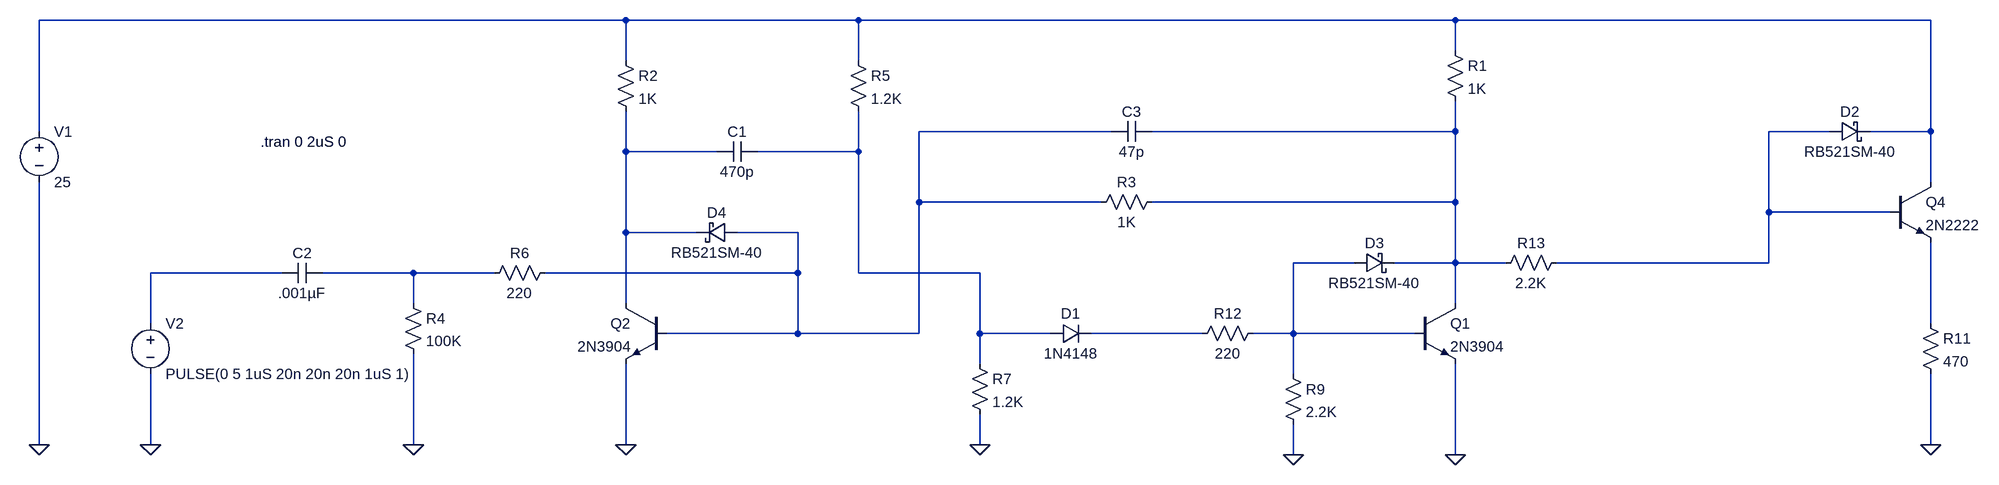
[diagram p0: schematic monostable.asc]
monostable.asc, the LTspice schematic file:
Version 4
SHEET 1 1792 680
WIRE -352 -320 -1280 -320
WIRE 16 -320 -352 -320
WIRE 960 -320 16 -320
WIRE 1712 -320 960 -320
WIRE 960 -272 960 -320
WIRE -352 -256 -352 -320
WIRE 16 -256 16 -320
WIRE -1280 -144 -1280 -320
WIRE 416 -144 112 -144
WIRE 960 -144 960 -192
WIRE 960 -144 480 -144
WIRE 1552 -144 1456 -144
WIRE 1712 -144 1712 -320
WIRE 1712 -144 1616 -144
WIRE -352 -112 -352 -176
WIRE -208 -112 -352 -112
WIRE 16 -112 16 -176
WIRE 16 -112 -144 -112
WIRE 1712 -64 1712 -144
WIRE 112 -32 112 -144
WIRE 400 -32 112 -32
WIRE 960 -32 960 -144
WIRE 960 -32 480 -32
WIRE 1456 -16 1456 -144
WIRE 1648 -16 1456 -16
WIRE -352 16 -352 -112
WIRE -240 16 -352 16
WIRE -80 16 -176 16
WIRE 800 64 704 64
WIRE 960 64 960 -32
WIRE 960 64 864 64
WIRE 1040 64 960 64
WIRE 1456 64 1456 -16
WIRE 1456 64 1120 64
WIRE -896 80 -1104 80
WIRE -688 80 -832 80
WIRE -560 80 -688 80
WIRE -80 80 -80 16
WIRE -80 80 -480 80
WIRE 16 80 16 -112
WIRE 208 80 16 80
WIRE -688 128 -688 80
WIRE -352 128 -352 16
WIRE 960 128 960 64
WIRE -1104 160 -1104 80
WIRE 1712 160 1712 32
WIRE -80 176 -80 80
WIRE -80 176 -288 176
WIRE 112 176 112 -32
WIRE 112 176 -80 176
WIRE 208 176 208 80
WIRE 320 176 208 176
WIRE 560 176 384 176
WIRE 704 176 704 64
WIRE 704 176 640 176
WIRE 896 176 704 176
WIRE 208 224 208 176
WIRE 704 240 704 176
WIRE -1280 352 -1280 -64
WIRE -1104 352 -1104 240
WIRE -688 352 -688 208
WIRE -352 352 -352 224
WIRE 208 352 208 304
WIRE 1712 352 1712 240
WIRE 704 368 704 320
WIRE 960 368 960 224
FLAG -352 352 0
FLAG 960 368 0
FLAG -1280 352 0
FLAG -688 352 0
FLAG -1104 352 0
FLAG 208 352 0
FLAG 1712 352 0
FLAG 704 368 0
SYMBOL npn 896 128 R0
SYMATTR InstName Q1
SYMATTR Value 2N3904
SYMBOL npn -288 128 M0
SYMATTR InstName Q2
SYMATTR Value 2N3904
SYMBOL res 944 -288 R0
SYMATTR InstName R1
SYMATTR Value 1K
SYMBOL res -368 -272 R0
SYMATTR InstName R2
SYMATTR Value 1K
SYMBOL cap -144 -128 R90
WINDOW 0 0 32 VBottom 2
WINDOW 3 32 32 VTop 2
SYMATTR InstName C1
SYMATTR Value 470p
SYMBOL res 496 -48 R90
WINDOW 0 0 56 VBottom 2
WINDOW 3 32 56 VTop 2
SYMATTR InstName R3
SYMATTR Value 1K
SYMBOL voltage -1280 -160 R0
WINDOW 123 0 0 Left 2
WINDOW 39 0 0 Left 2
SYMATTR InstName V1
SYMATTR Value 25
SYMBOL res -704 112 R0
SYMATTR InstName R4
SYMATTR Value 100K
SYMBOL cap -832 64 R90
WINDOW 0 0 32 VBottom 2
WINDOW 3 32 32 VTop 2
SYMATTR InstName C2
SYMATTR Value .001µF
SYMBOL voltage -1104 144 R0
WINDOW 123 0 0 Left 2
WINDOW 39 0 0 Left 2
SYMATTR InstName V2
SYMATTR Value PULSE(0 5 1uS 20n 20n 20n 1uS 1)
SYMBOL res 0 -272 R0
SYMATTR InstName R5
SYMATTR Value 1.2K
SYMBOL res -464 64 R90
WINDOW 0 0 56 VBottom 2
WINDOW 3 32 56 VTop 2
SYMATTR InstName R6
SYMATTR Value 220
SYMBOL diode 320 160 M90
WINDOW 0 0 32 VBottom 2
WINDOW 3 32 32 VTop 2
SYMATTR InstName D1
SYMATTR Value 1N4148
SYMBOL schottky 800 48 M90
WINDOW 0 0 32 VBottom 2
WINDOW 3 32 32 VTop 2
SYMATTR InstName D3
SYMATTR Value RB521SM-40
SYMATTR Description Diode
SYMATTR Type diode
SYMBOL schottky -176 0 R90
WINDOW 0 0 32 VBottom 2
WINDOW 3 32 32 VTop 2
SYMATTR InstName D4
SYMATTR Value RB521SM-40
SYMATTR Description Diode
SYMATTR Type diode
SYMBOL res 192 208 R0
SYMATTR InstName R7
SYMATTR Value 1.2K
SYMBOL cap 480 -160 R90
WINDOW 0 0 32 VBottom 2
WINDOW 3 32 32 VTop 2
SYMATTR InstName C3
SYMATTR Value 47p
SYMBOL npn 1648 -64 R0
SYMATTR InstName Q4
SYMATTR Value 2N2222
SYMBOL res 1696 144 R0
SYMATTR InstName R11
SYMATTR Value 470
SYMBOL schottky 1552 -160 M90
WINDOW 0 0 32 VBottom 2
WINDOW 3 32 32 VTop 2
SYMATTR InstName D2
SYMATTR Value RB521SM-40
SYMATTR Description Diode
SYMATTR Type diode
SYMBOL res 656 160 R90
WINDOW 0 0 56 VBottom 2
WINDOW 3 32 56 VTop 2
SYMATTR InstName R12
SYMATTR Value 220
SYMBOL res 688 224 R0
SYMATTR InstName R9
SYMATTR Value 2.2K
SYMBOL res 1136 48 R90
WINDOW 0 0 56 VBottom 2
WINDOW 3 32 56 VTop 2
SYMATTR InstName R13
SYMATTR Value 2.2K
TEXT -930 -128 Left 2 !.tran 0 2uS 0

The netlist it stands for:
* monostable.asc
Q1 N003 N007 0 0 2N3904
Q2 N005 N002 0 0 2N3904
R1 N001 N003 1K
R2 N001 N005 1K
C1 N006 N005 470p
R3 N003 N002 1K
V1 N001 0 25
R4 N009 0 100K
C2 N009 N008 .001µF
V2 N008 0 PULSE(0 5 1uS 20n 20n 20n 1uS 1)
R5 N001 N006 1.2K
R6 N002 N009 220
D1 N006 N011 1N4148
D3 N007 N003 RB521SM-40
D4 N002 N005 RB521SM-40
R7 N006 0 1.2K
C3 N003 N002 47p
Q4 N001 N004 N010 0 2N2222
R11 N010 0 470
D2 N004 N001 RB521SM-40
R12 N007 N011 220
R9 N007 0 2.2K
R13 N004 N003 2.2K
.model D D
.lib standard.dio
.model NPN NPN
.model PNP PNP
.lib standard.bjt
.tran 0 2uS 0
.backanno
.end